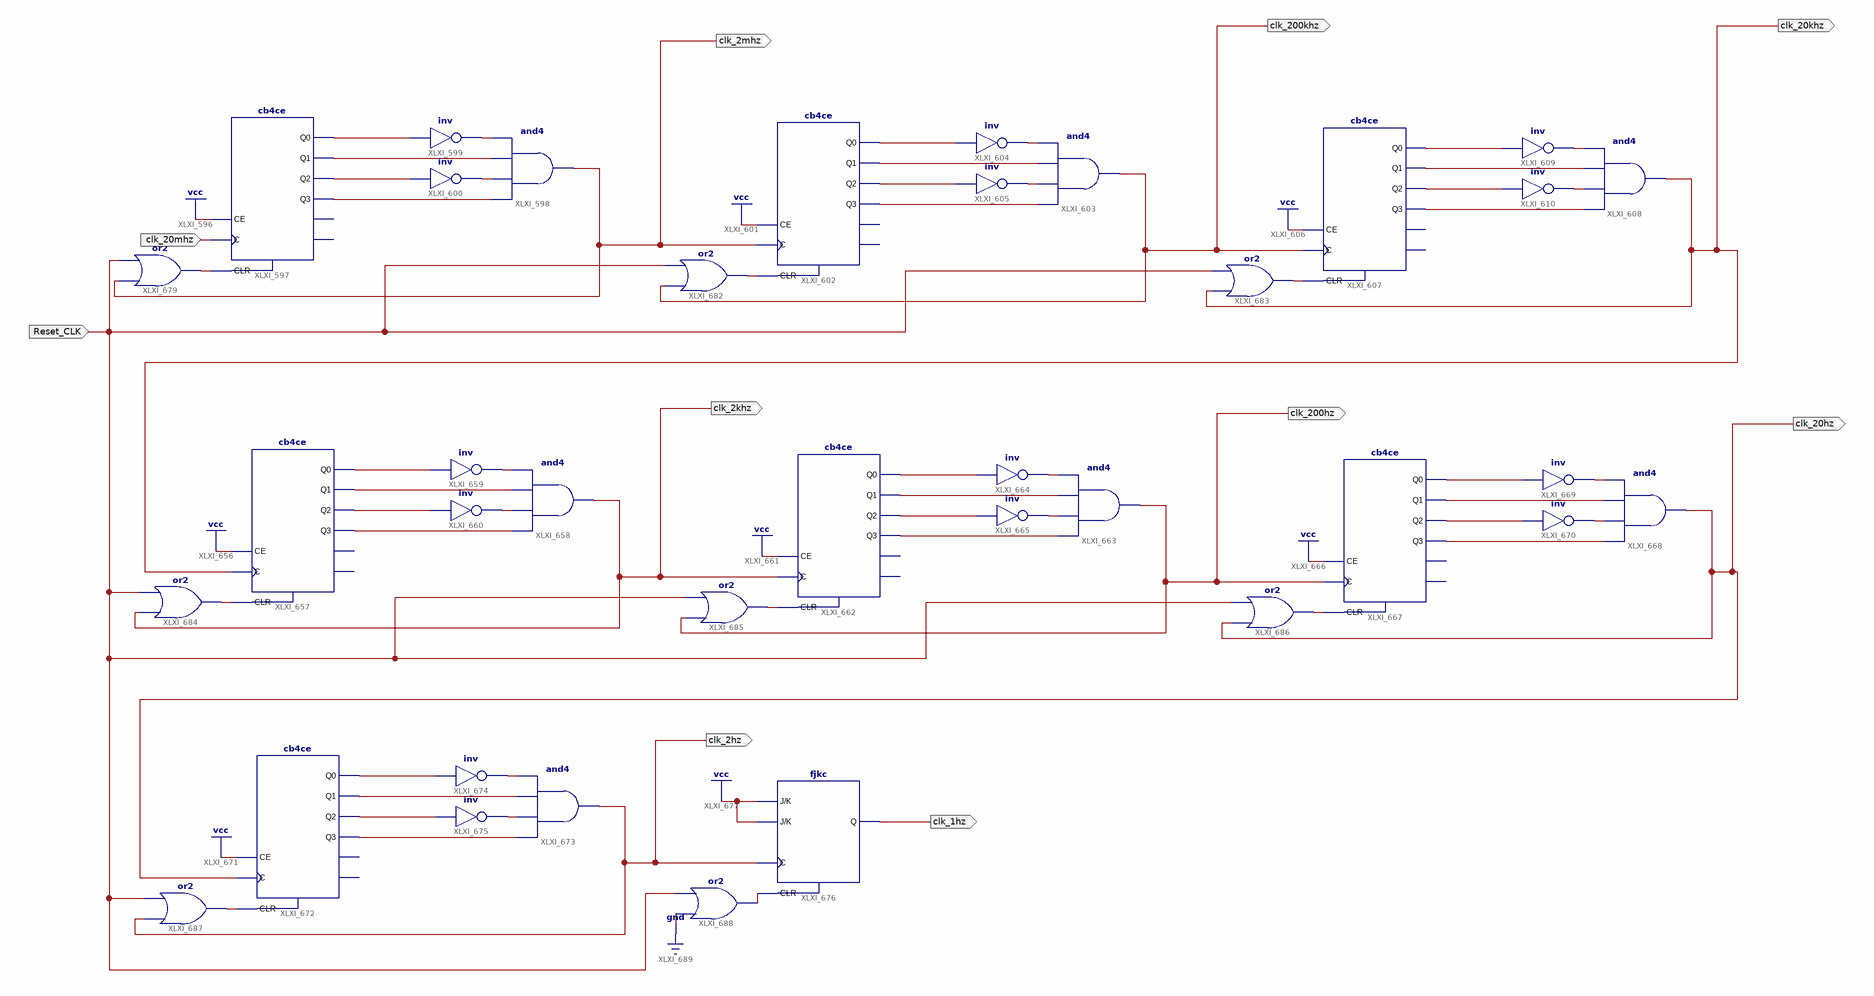
[diagram p0: schematic sheet 1]
// Xilinx ISE schematic Clock_mod_rester.sch (spartan6) as structural Verilog: 37 symbols, 10 ports
module Clock_mod_rester (
  input  clk_20mhz,
  input  Reset_CLK,
  output clk_2mhz,
  output clk_200khz,
  output clk_2khz,
  output clk_200hz,
  output clk_2hz,
  output clk_20khz,
  output clk_20hz,
  output clk_1hz
);

  wire XLXN_1065, XLXN_1066, XLXN_1068, XLXN_1069, XLXN_1070, XLXN_1071, XLXN_1073, XLXN_1074, XLXN_1076,
       XLXN_1077, XLXN_1078, XLXN_1079, XLXN_1082, XLXN_1083, XLXN_1085, XLXN_1086, XLXN_1087, XLXN_1088,
       XLXN_1172, XLXN_1173, XLXN_1175, XLXN_1176, XLXN_1177, XLXN_1178, XLXN_1181, XLXN_1182, XLXN_1184,
       XLXN_1185, XLXN_1186, XLXN_1187, XLXN_1190, XLXN_1191, XLXN_1193, XLXN_1194, XLXN_1195, XLXN_1196,
       XLXN_1199, XLXN_1200, XLXN_1202, XLXN_1203, XLXN_1204, XLXN_1205, XLXN_1212, XLXN_1213, XLXN_1215,
       XLXN_1216, XLXN_1217, XLXN_1218, XLXN_1219, XLXN_1220;

  cb4ce XLXI_597 (
    .C(clk_20mhz), .CE(1'b1), .CLR(XLXN_1213), .Q0(XLXN_1068), .Q1(XLXN_1069), .Q2(XLXN_1070), .Q3(XLXN_1071));  // open: CEO, TC
  and XLXI_598 (clk_2mhz, XLXN_1071, XLXN_1066, XLXN_1069, XLXN_1065);
  not XLXI_599 (XLXN_1065, XLXN_1068);
  not XLXI_600 (XLXN_1066, XLXN_1070);
  cb4ce XLXI_602 (
    .C(clk_2mhz), .CE(1'b1), .CLR(XLXN_1215), .Q0(XLXN_1076), .Q1(XLXN_1077), .Q2(XLXN_1078), .Q3(XLXN_1079));  // open: CEO, TC
  and XLXI_603 (clk_200khz, XLXN_1079, XLXN_1074, XLXN_1077, XLXN_1073);
  not XLXI_604 (XLXN_1073, XLXN_1076);
  not XLXI_605 (XLXN_1074, XLXN_1078);
  cb4ce XLXI_607 (
    .C(clk_200khz), .CE(1'b1), .CLR(XLXN_1216), .Q0(XLXN_1085), .Q1(XLXN_1086), .Q2(XLXN_1087), .Q3(XLXN_1088));  // open: CEO, TC
  and XLXI_608 (clk_20khz, XLXN_1088, XLXN_1083, XLXN_1086, XLXN_1082);
  not XLXI_609 (XLXN_1082, XLXN_1085);
  not XLXI_610 (XLXN_1083, XLXN_1087);
  cb4ce XLXI_657 (
    .C(clk_20khz), .CE(1'b1), .CLR(XLXN_1217), .Q0(XLXN_1175), .Q1(XLXN_1176), .Q2(XLXN_1177), .Q3(XLXN_1178));  // open: CEO, TC
  and XLXI_658 (clk_2khz, XLXN_1178, XLXN_1173, XLXN_1176, XLXN_1172);
  not XLXI_659 (XLXN_1172, XLXN_1175);
  not XLXI_660 (XLXN_1173, XLXN_1177);
  cb4ce XLXI_662 (
    .C(clk_2khz), .CE(1'b1), .CLR(XLXN_1218), .Q0(XLXN_1184), .Q1(XLXN_1185), .Q2(XLXN_1186), .Q3(XLXN_1187));  // open: CEO, TC
  and XLXI_663 (clk_200hz, XLXN_1187, XLXN_1182, XLXN_1185, XLXN_1181);
  not XLXI_664 (XLXN_1181, XLXN_1184);
  not XLXI_665 (XLXN_1182, XLXN_1186);
  cb4ce XLXI_667 (
    .C(clk_200hz), .CE(1'b1), .CLR(XLXN_1219), .Q0(XLXN_1193), .Q1(XLXN_1194), .Q2(XLXN_1195), .Q3(XLXN_1196));  // open: CEO, TC
  and XLXI_668 (clk_20hz, XLXN_1196, XLXN_1191, XLXN_1194, XLXN_1190);
  not XLXI_669 (XLXN_1190, XLXN_1193);
  not XLXI_670 (XLXN_1191, XLXN_1195);
  cb4ce XLXI_672 (
    .C(clk_20hz), .CE(1'b1), .CLR(XLXN_1220), .Q0(XLXN_1202), .Q1(XLXN_1203), .Q2(XLXN_1204), .Q3(XLXN_1205));  // open: CEO, TC
  and XLXI_673 (clk_2hz, XLXN_1205, XLXN_1200, XLXN_1203, XLXN_1199);
  not XLXI_674 (XLXN_1199, XLXN_1202);
  not XLXI_675 (XLXN_1200, XLXN_1204);
  fjkc XLXI_676 (.C(clk_2hz), .CLR(XLXN_1212), .J(1'b1), .K(1'b1), .Q(clk_1hz));
  or XLXI_679 (XLXN_1213, clk_2mhz, Reset_CLK);
  or XLXI_682 (XLXN_1215, clk_200khz, Reset_CLK);
  or XLXI_683 (XLXN_1216, clk_20khz, Reset_CLK);
  or XLXI_684 (XLXN_1217, clk_2khz, Reset_CLK);
  or XLXI_685 (XLXN_1218, clk_200hz, Reset_CLK);
  or XLXI_686 (XLXN_1219, clk_20hz, Reset_CLK);
  or XLXI_687 (XLXN_1220, clk_2hz, Reset_CLK);
  or XLXI_688 (XLXN_1212, 1'b0, Reset_CLK);
endmodule
